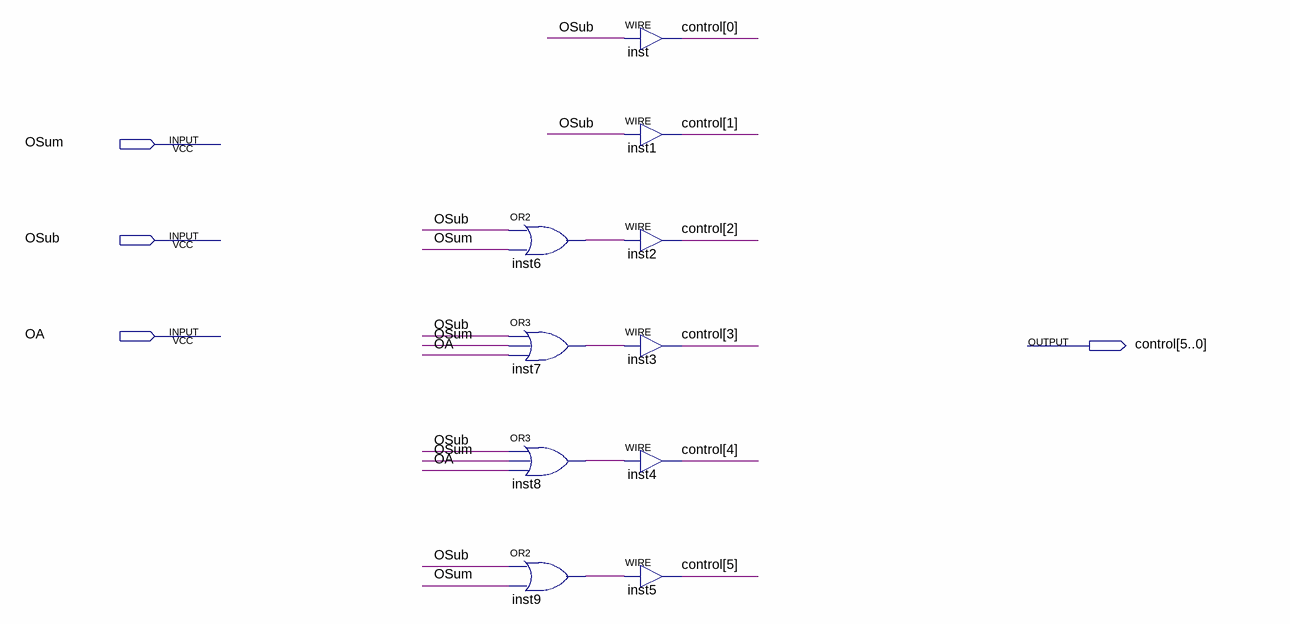
[diagram p0: schematic sheet]
// Quartus schematic ALUMapper.bdf as structural Verilog: 10 symbols, 4 pins
module ALUMapper (
  input  OSum,
  input  OSub,
  input  OA,
  output [5:0] control
);

  wire inst6_out, inst7_out, inst8_out, inst9_out;

  or inst6 (inst6_out, OSub, OSum);
  or inst7 (inst7_out, OSub, OSum, OA);
  or inst8 (inst8_out, OSub, OSum, OA);
  or inst9 (inst9_out, OSub, OSum);
  assign control[0] = OSub;  // WIRE inst
  assign control[1] = OSub;  // WIRE inst1
  assign control[2] = inst6_out;  // WIRE inst2
  assign control[3] = inst7_out;  // WIRE inst3
  assign control[4] = inst8_out;  // WIRE inst4
  assign control[5] = inst9_out;  // WIRE inst5
endmodule
